# Altium project alarm_clock.PrjPcb
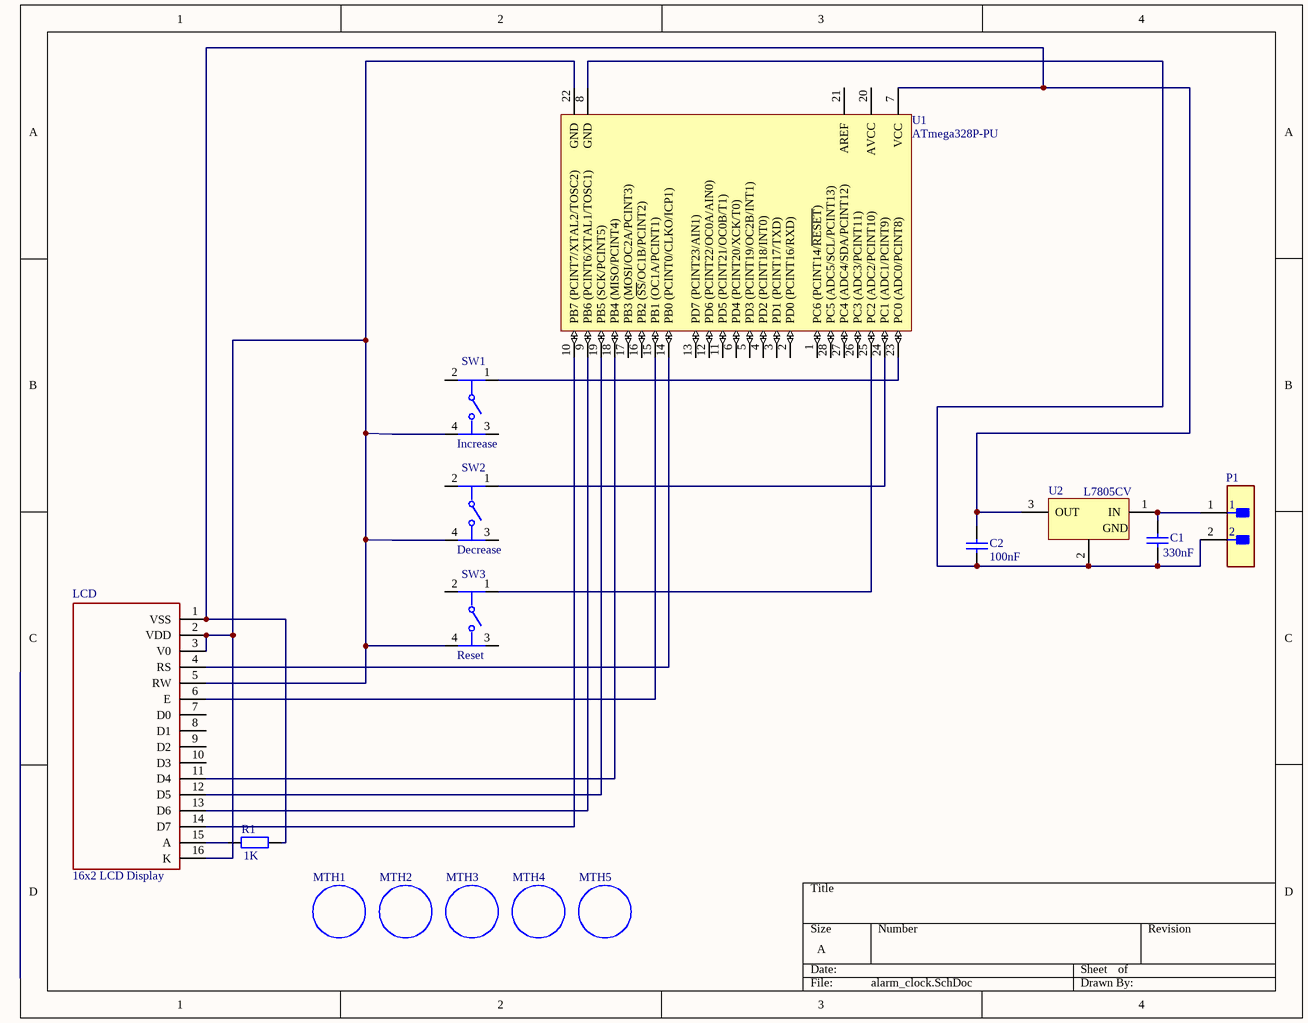
[diagram p0: alarm_clock.SchDoc]
1 sheet, 15 parts. Net scope: global (net labels, ports and power ports of the same name join across sheets).
Board file: alarm_clock.PcbDoc

## Sheet alarm_clock.SchDoc
size A

### Parts
C1  value 330nF  [RAD-0.3]  (hidden comment: Cap)
C2  value 100nF  [RAD-0.3]  (hidden comment: Cap)
LCD  16x2 LCD Display  [LCD1602]
MTH1  (no value)  [MTH]
MTH2  (no value)  [MTH]
MTH3  (no value)  [MTH]
MTH4  (no value)  [MTH]
MTH5  (no value)  [MTH]
P1  B2B-XH-A(LF)(SN)  [FP-B2B-XH-A_LF_SN-MFG]  (value not drawn)
R1  value 1K  [AXIAL-0.4]  (hidden comment: Res2)
SW1  Increase  [FP-1-1825910-0-MFG]
SW2  Decrease  [FP-1-1825910-0-MFG]
SW3  Reset  [FP-1-1825910-0-MFG]
U1  ATmega328P-PU  [28P3]
U2  L7805CV  [TO220]

### Nets
NetC1_1: C1.1 C2.1 P1.2 U1.8(GND) U2.2(GND)
NetC1_2: C1.2 P1.1 U2.1(IN)
NetC2_2: C2.2 LCD.1(VSS) R1.2 U1.7(VCC) U2.3(OUT)
NetLCD_2: LCD.2(VDD) LCD.3(V0) LCD.5(RW) LCD.16(K) SW1.4 SW2.4 SW3.4 U1.22(GND)
NetLCD_4: LCD.4(RS) U1.14(PB0_(PCINT0/CLKO/ICP1))
NetLCD_6: LCD.6(E) U1.15(PB1_(OC1A/PCINT1))
NetLCD_11: LCD.11(D4) U1.18(PB4_(MISO/PCINT4))
NetLCD_12: LCD.12(D5) U1.19(PB5_(SCK/PCINT5))
NetLCD_13: LCD.13(D6) U1.9(PB6_(PCINT6/XTAL1/TOSC1))
NetLCD_14: LCD.14(D7) U1.10(PB7_(PCINT7/XTAL2/TOSC2))
NetLCD_15: LCD.15(A) R1.1
NetSW1_1: SW1.1 U1.23(PC0_(ADC0/PCINT8))
NetSW2_1: SW2.1 U1.24(PC1_(ADC1/PCINT9))
NetSW3_1: SW3.1 U1.25(PC2_(ADC2/PCINT10))

Not connected (* = marked no-connect by the designer): LCD 7(D0) 8(D1) 9(D2) 10(D3); SW1 2 3; SW2 2 3; SW3 2 3; U1 1(PC6_(PCINT14/~{RESET})) 2(PD0_(PCINT16/RXD)) 3(PD1_(PCINT17/TXD)) 4(PD2_(PCINT18/INT0)) 5(PD3_(PCINT19/OC2B/INT1)) 6(PD4_(PCINT20/XCK/T0)) 11(PD5_(PCINT21/OC0B/T1)) 12(PD6_(PCINT22/OC0A/AIN0)) 13(PD7_(PCINT23/AIN1)) 16(PB2_(~{SS}/OC1B/PCINT2)) 17(PB3_(MOSI/OC2A/PCINT3)) 20(AVCC) 21(AREF) 26(PC3_(ADC3/PCINT11)) 27(PC4_(ADC4/SDA/PCINT12)) 28(PC5_(ADC5/SCL/PCINT13))

### Library data of the parts
C1 C2 = Cap: Capacitor; Published: 8-Jun-2000; LatestRevisionDate: 17-Jul-2002; LatestRevisionNote: Re-released for DXP Platform.; PackageReference: RAD-0.3; Publisher: Altium Limited; PackageDescription: Radial Cap, Thru-Hole; 2 Leads; 0.3 in Pin Spacing
LCD = LCD1602
MTH1-MTH5 = MTH
P1 = CMP-2000-05888-3: CONN HEADER VERT 2POS 2.5MM; Current Rating: 3A; Voltage Rating: 250V; Number of Contacts: 2; Contact Resistance: 20mR; Wire/Cable Gauge: 22AWG; Insulation Resistance: 1GR; Connector Type: Male Pin; Packaging: Bulk; Contact Material: Brass; Lead Free: Lead Free; Orientation: Straight; Contact Plating: Tin; Max Current Rating: 3A; Termination: Solder; Fastening Type: Detent; Depth: 5.75mm; Housing Material: Polyamide; REACH SVHC: No SVHC; Series: XH; Voltage Rating (AC): 250V; Number of Positions: 2; Color: Natural; Contact Type: Male Pin; Max Voltage Rating (DC): 250V; Pitch: 2.5mm; Lead Pitch: 2.5mm; Mount: Through Hole; Max Operating Temperature: 85°C; Length: 7.4mm; Max Voltage Rating (AC): 250V; Min Operating Temperature: -25°C; Number of Rows: 1; Housing Color: White
R1 = Res2: Resistor; Published: 8-Jun-2000; LatestRevisionDate: 17-Jul-2002; LatestRevisionNote: Re-released for DXP Platform.; PackageReference: AXIAL-0.4; Publisher: Altium Limited; PackageDescription: Axial Device, Thru-Hole; 2 Leads; 0.4 in Pin Spacing
SW1-SW3 = CMP-03407-000018-1: SWITCH TACTILE SPST-NO 0.05A 24V; Switch Function: Off-Mom; Mechanical Life: 100000Cycles; Actuator Material: Nylon; Actuator Color: Blue; Contact Current Rating: 50mA; Illumination Type: Non-Illuminated; Throw Configuration: SPST; Actuator Length: 3.4mm; Operating Force: 1.56N; Actuator Type: Standard; Contact Resistance: 100mR; Switch Travel: 0.25mm; Depth: 5.99mm; Contact Plating: Silver; Max Operating Temperature: 85°C; Electrical Life: 100000Cycles; Min Operating Temperature: -35°C; RoHS Compliant: Yes; Max Voltage Rating (DC): 24V; Mount: Through Hole; Packaging: Loose Piece; Length: 5.99mm; Series: FSMJ, Alcoswitch; Orientation: Straight; Contact Material: Brass; Radiation Hardening: No; Package Quantity: 750; Max Current Rating: 50mA; Termination: PC Pins; Type: Switch; Voltage Rating (DC): 24V
U1 = CMP-0095-00013-2: 8-bit AVR Microcontroller, 32KB Flash, 1KB EEPROM, 2KB SRAM, 28-pin PDIP, Industrial Grade (-40°C to 85°C); RevisionNote: DatasheetVersion updated. URLs added.; PackageVersion: revB, Sep-2001; PackageDescription: 28-lead (0.300"/7.62mm Wide) Plastic Dual Inline Package (PDIP); DatasheetVersion: revD, May-2011; ComponentLink1Description: Manufacturer URL; ComponentLink1URL: http://www.atmel.com/; PackageReference: 28P3; ComponentLink2Description: ATmega48A/48PA/88A/88PA/168A/168PA/328/328P Datasheet; ComponentLink3URL: http://www.atmel.com/dyn/resources/prod_documents/8271S.pdf; ComponentLink2URL: http://www.atmel.com/dyn/resources/prod_documents/8271.pdf; ComponentLink3Description: ATmega48A/48PA/88A/88PA/168A/168PA/328/328P Summary
U2 = CMP-0244-00483-1: Positive Voltage Regulator, 5V, 3-Pin TO-220; PackageDescription: TO, Thru-Hole, Vertical, Heatsink Mounted; 3 In-Line Leads; Pitch 2.54 mm; ComponentLink2Description: Datasheet; PackageReference: TO220; ComponentLink3URL: http://www.st.com/internet/com/TECHNICAL_RESOURCES/TECHNICAL_LITERATURE/PACKAGE_INFORMATION/CD00004649.pdf; DatasheetVersion: 16/11/2011; ComponentLink1Description: Manufacturer URL; ComponentLink1URL: http://www.st.com; PackageVersion: ver3.0; ComponentLink3Description: Package Specification; ComponentLink2URL: http://www.st.com/internet/com/TECHNICAL_RESOURCES/TECHNICAL_LITERATURE/DATASHEET/CD00000444.pdf